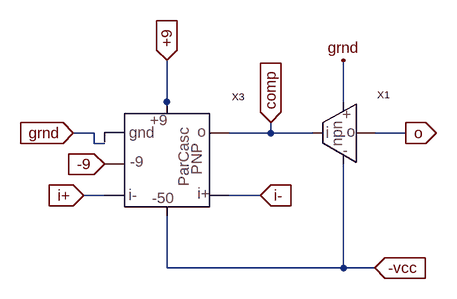
[diagram p0: schematic ss-12-.asc]
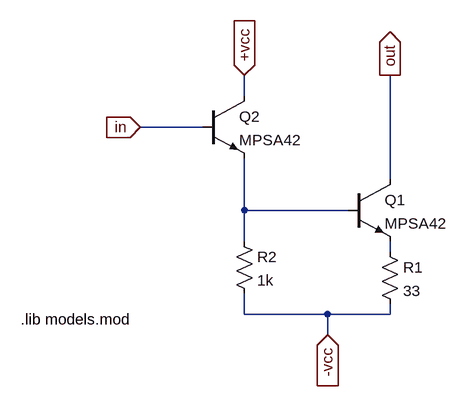
[diagram p1: sub-circuit ss-vas-npn.asc]
ss-12-.asc, the LTspice schematic file:
Version 4
SHEET 1 880 680
WIRE -544 80 -544 16
WIRE -272 80 -272 16
WIRE -544 96 -544 80
WIRE -656 128 -688 128
WIRE -384 128 -384 112
WIRE -384 128 -448 128
WIRE -320 128 -384 128
WIRE -176 128 -224 128
WIRE -656 144 -656 128
WIRE -640 144 -656 144
WIRE -640 224 -672 224
WIRE -400 224 -448 224
WIRE -544 336 -544 256
WIRE -272 336 -272 176
WIRE -272 336 -544 336
WIRE -224 336 -272 336
FLAG -640 176 -9
IOPIN -640 176 In
FLAG -688 128 grnd
IOPIN -688 128 In
FLAG -400 224 i-
IOPIN -400 224 In
FLAG -672 224 i+
IOPIN -672 224 In
FLAG -176 128 o
IOPIN -176 128 Out
FLAG -384 112 comp
IOPIN -384 112 In
FLAG -224 336 -vcc
IOPIN -224 336 In
FLAG -544 16 +9
IOPIN -544 16 In
FLAG -272 16 grnd
SYMBOL ss-par-pnp -544 160 R0
SYMATTR InstName X3
SYMATTR SpiceLine rc=2.4k
SYMBOL ss-vas-npn -272 128 R0
SYMATTR InstName X1

ss-vas-npn.asc, the sub-circuit schematic file:
Version 4
SHEET 1 880 680
WIRE -272 -400 -272 -432
WIRE -336 -352 -432 -352
WIRE -48 -272 -48 -432
WIRE -272 -224 -272 -304
WIRE -112 -224 -272 -224
WIRE -272 -176 -272 -224
WIRE -48 -160 -48 -176
WIRE -272 -64 -272 -96
WIRE -144 -64 -272 -64
WIRE -48 -64 -48 -80
WIRE -48 -64 -144 -64
WIRE -144 -32 -144 -64
FLAG -432 -352 in
IOPIN -432 -352 In
FLAG -144 -32 -vcc
IOPIN -144 -32 In
FLAG -272 -432 +vcc
IOPIN -272 -432 In
FLAG -48 -432 out
IOPIN -48 -432 Out
DATAFLAG -272 -224 "round($*100)/100"
SYMBOL npn -112 -272 R0
SYMATTR InstName Q1
SYMATTR Value MPSA42
SYMBOL res -64 -176 R0
SYMATTR InstName R1
SYMATTR Value 33
SYMBOL npn -336 -400 R0
SYMATTR InstName Q2
SYMATTR Value MPSA42
SYMBOL res -288 -192 R0
SYMATTR InstName R2
SYMATTR Value 1k
TEXT -616 -56 Left 2 !.lib models.mod

The netlist it stands for:
* ss-12-.asc
XX3 i+ i- comp +9 -vcc grnd -9 ss-par-pnp rc=2.4k  ; pins i- i+ o +9 -50 grnd -9
XX1 comp -vcc grnd o ss-vas-npn

* block symbol definitions
.subckt ss-vas-npn in -vcc +vcc out
Q1 out N001 N002 0 MPSA42
R1 N002 -vcc 33
Q2 +vcc in N001 0 MPSA42
R2 N001 -vcc 1k
.lib models.mod
.ends ss-vas-npn

.model NPN NPN
.model PNP PNP
.lib standard.bjt
.backanno
.end